# EAGLE design top (EAGLE 9.3.1)
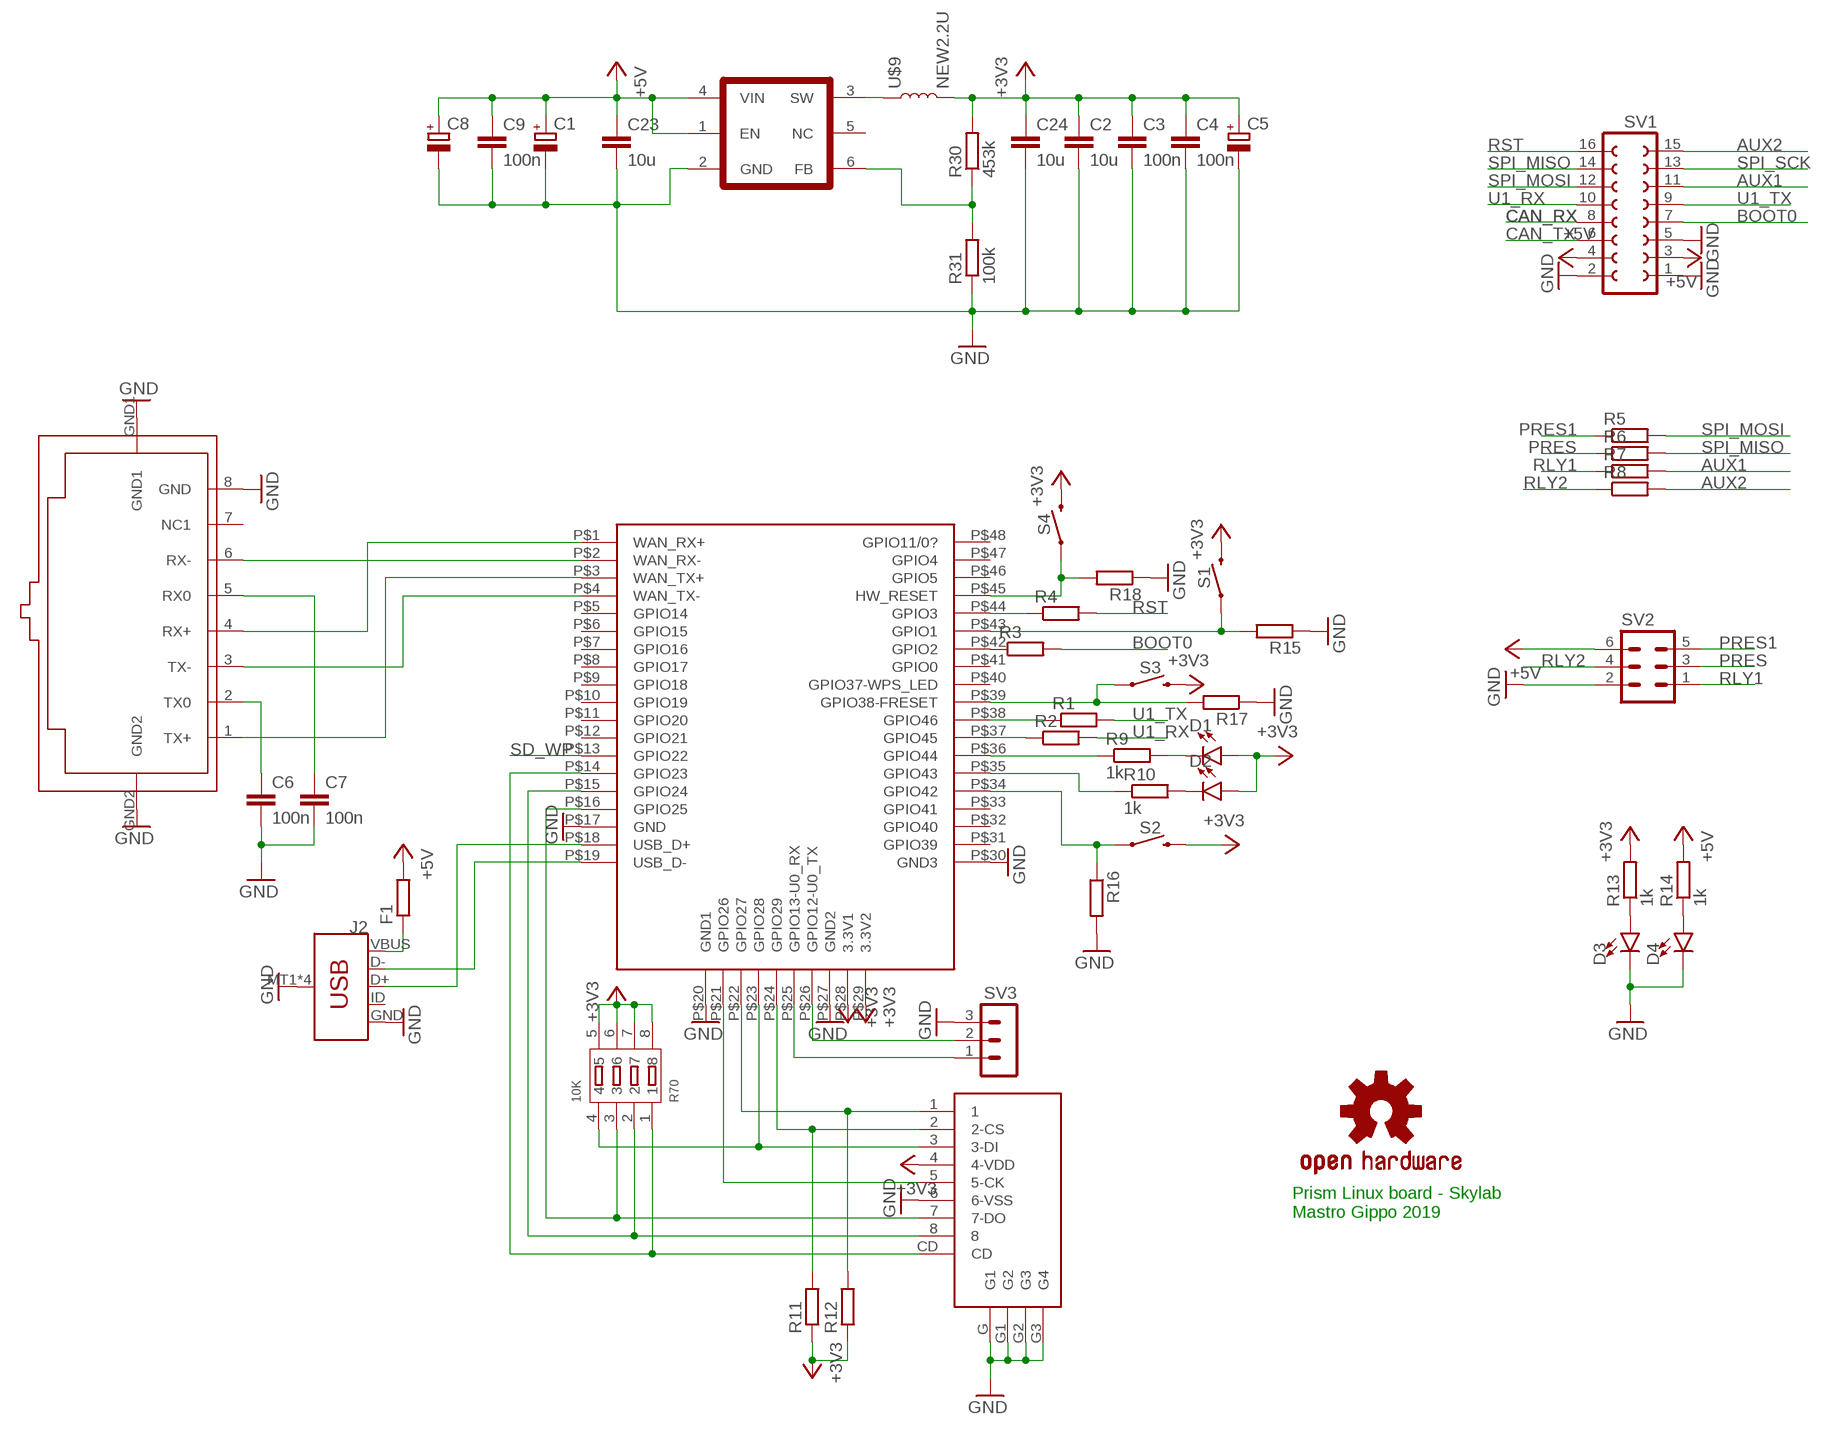
[diagram p0: schematic, sheet 1]

## Parts
C1  CPOL-EUB/3528-21R  [B/3528-21R]
C2  10u  C-EUC0805K  [C0805K]
C3  100n  C-EUC0805K  [C0805K]
C4  100n  C-EUC0805K  [C0805K]
C5  CPOL-EUB/3528-21R  [B/3528-21R]
C6  100n  C-EUC0805K  [C0805K]
C7  100n  C-EUC0805K  [C0805K]
C8  CPOL-EUB/3528-21R  [B/3528-21R]
C9  100n  C-EUC0805K  [C0805K]
C23  10u  C-EUC0805K  [C0805K]
C24  10u  C-EUC0805K  [C0805K]
D1  LED3MM  [LED_3MM]
D2  LED3MM  [LED_3MM]
D3  LED1206  [LED-1206]
D4  LED1206  [LED-1206]
F1  R-EU_R0603  [R0603]
J2  USB_MICRO-B_SMT  [USB-MICROB]
R1  R-EU_R0805  [R0805]
R2  R-EU_R0805  [R0805]
R3  R-EU_R0805  [R0805]
R4  R-EU_R0805  [R0805]
R5  R-EU_R0805  [R0805]
R6  R-EU_R0805  [R0805]
R7  R-EU_R0805  [R0805]
R8  R-EU_R0805  [R0805]
R9  1k  R-EU_R0805  [R0805]
R10  1k  R-EU_R0805  [R0805]
R11  R-EU_R0805  [R0805]
R12  R-EU_R0805  [R0805]
R13  1k  R-EU_R0805  [R0805]
R14  1k  R-EU_R0805  [R0805]
R15  R-EU_R0805  [R0805]
R16  R-EU_R0805  [R0805]
R17  R-EU_R0805  [R0805]
R18  R-EU_R0805  [R0805]
R30  453k  R_EU  [R0805]
R31  100k  R_EU  [R0805]
R70  10K  SMD-RES-ARRAY-1K-4R(RA1206-8)  [RA1206-8]
S1  MOMENTARY-SWITCH-SPST-SMD-6.0X3.5MM  [TACTILE_SWITCH_SMD_6.0X3.5MM]
S2  MOMENTARY-SWITCH-SPST-SMD-6.0X3.5MM  [TACTILE_SWITCH_SMD_6.0X3.5MM]
S3  MOMENTARY-SWITCH-SPST-PTH-RIGHT-ANGLE  [TACTILE_SWITCH_PTH_RIGHT_ANGLE]
S4  MOMENTARY-SWITCH-SPST-SMD-6.0X3.5MM  [TACTILE_SWITCH_SMD_6.0X3.5MM]
SV1  FE08-2  [FE08-2]
SV2  MA03-2  [MA03-2]
SV3  MA03-1  [MA03-1]
U$1  RJ45-TRAFO  [RJ45-TRAFO]
U$2  SKW92B  [SKW92]
U$3  MICRO_SD  [MICRO_SD_C]
U$4  OSHW-LOGOS  [OSHW-LOGO-S]
U$8  TLV62658  [SOT23-6]
U$9  NEW2.2U  [INDUCTOR_4X4MM]

## Nets
+3V3: C2.1 C3.1 C4.1 C5.+ C24.1 D1.A D2.A R11.1 R12.1 R13.2 R30.2 R70.5 R70.6 R70.7 R70.8 S1.2 S2.2 S3.2 S4.2 U$2.P$28(3.3V1) U$2.P$29(3.3V2) U$3.4(4-VDD) U$9.P$2
+5V: C1.+ C8.+ C9.1 C23.1 F1.2 R14.2 SV1.3 SV1.4 SV2.6 U$8.1(EN) U$8.4(VIN)
AUX1: R7.2 SV1.11
AUX2: R8.2 SV1.15
BOOT0: R3.2 SV1.7
CAN_RX: SV1.8
CAN_TX: SV1.6
GND: C1.- C2.2 C3.2 C4.2 C5.- C6.2 C7.2 C8.- C9.2 C23.2 C24.2 D3.C D4.C J2.GND J2.MT1(SHIELD) J2.MT2(SHIELD) J2.P$1(SHIELD) J2.P$2(SHIELD) R15.1 R16.2 R17.1 R18.1 R31.1 SV1.1 SV1.2 SV1.5 SV2.2 SV3.3 U$1.8(GND) U$1.GND1 U$1.GND2 U$2.P$17(GND) U$2.P$20(GND1) U$2.P$27(GND2) U$2.P$30(GND3) U$3.6(6-VSS) U$3.G1(G2) U$3.G2(G3) U$3.G3(G4) U$3.G(G1) U$8.2(GND)
N$1: U$1.6(RX-) U$2.P$2(WAN_RX-)
N$2: U$1.4(RX+) U$2.P$1(WAN_RX+)
N$3: U$1.1(TX+) U$2.P$3(WAN_TX+)
N$4: U$1.3(TX-) U$2.P$4(WAN_TX-)
N$5: R11.2 U$2.P$24(GPIO29) U$3.2(2-CS)
N$6: R70.4 U$2.P$23(GPIO28) U$3.3(3-DI)
N$7: R12.2 U$2.P$22(GPIO27) U$3.1
N$8: U$2.P$21(GPIO26) U$3.5(5-CK)
N$9: R70.3 U$2.P$16(GPIO25) U$3.7(7-DO)
N$10: R70.2 U$2.P$15(GPIO24) U$3.8
N$11: R70.1 U$2.P$14(GPIO23) U$3.CD
N$12: R1.1 U$2.P$38(GPIO46)
N$13: R2.1 U$2.P$37(GPIO45)
N$14: R3.1 U$2.P$42(GPIO2)
N$15: R4.1 U$2.P$44(GPIO3)
N$16: D1.K(C) R9.2
N$17: SV3.2 U$2.P$26(GPIO12-U0_TX)
N$18: SV3.1 U$2.P$25(GPIO13-U0_RX)
N$19: D2.K(C) R10.2
N$20: R9.1 U$2.P$36(GPIO44)
N$21: R10.1 U$2.P$35(GPIO43)
N$22: D3.A R13.1
N$23: D4.A R14.1
N$24: R15.2 S1.1 U$2.P$43(GPIO1)
N$25: R16.1 S2.1 U$2.P$34(GPIO42)
N$26: R17.2 S3.1 U$2.P$39(GPIO38-FRESET)
N$27: R18.2 S4.1 U$2.P$45(HW_RESET)
N$28: C7.1 U$1.5(RX0)
N$29: C6.1 U$1.2(TX0)
N$30: J2.D+ U$2.P$18(USB_D+)
N$31: J2.D- U$2.P$19(USB_D-)
N$32: F1.1 J2.VBUS
N$41: U$8.3(SW) U$9.P$1
N$46: R30.1 R31.2 U$8.6(FB)
PRES: R6.1 SV2.3
PRES1: R5.1 SV2.5
RLY1: R7.1 SV2.1
RLY2: R8.1 SV2.4
RST: R4.2 SV1.16
SD_WP: U$2.P$13(GPIO22)
SPI_MISO: R6.2 SV1.14
SPI_MOSI: R5.2 SV1.12
SPI_SCK: SV1.13
U1_RX: R2.2 SV1.10
U1_TX: R1.2 SV1.9
Unconnected: J2.ID U$1.7(NC1) U$2.P$5(GPIO14) U$2.P$6(GPIO15) U$2.P$7(GPIO16) U$2.P$8(GPIO17) U$2.P$9(GPIO18) U$2.P$10(GPIO19) U$2.P$11(GPIO20) U$2.P$12(GPIO21) U$2.P$31(GPIO39) U$2.P$32(GPIO40) U$2.P$33(GPIO41) U$2.P$40(GPIO37-WPS_LED) U$2.P$41(GPIO0) U$2.P$46(GPIO5) U$2.P$47(GPIO4) U$2.P$48(GPIO11/0?) U$8.5(NC)

## Notes on the sheet
- Prism Linux board - Skylab
  Mastro Gippo 2019

## Library data of the parts
C1 C5 C8 = rcl:CPOL-EU: POLARIZED CAPACITOR, European symbol; SPICEPREFIX: C
C2-C4 C6 C7 C9 C23 C24 = resistor:C-EU: CAPACITOR, European symbol; SPICEPREFIX: C
D1 D2 = SparkFun-LED:LED: LED (Generic) Standard schematic elements and footprints for 5mm, 3mm, 1206, and 0603 sized LEDs. Generic LEDs with no color specified.; PROD_ID: DIO-08794
D3 D4 = SparkFun-LED:LED: LED (Generic) Standard schematic elements and footprints for 5mm, 3mm, 1206, and 0603 sized LEDs. Generic LEDs with no color specified.
F1 R1-R18 = rcl:R-EU_: RESISTOR, European symbol; SPICEPREFIX: R
J2 = SparkFun-Connectors:USB_MICRO-B: USB Type Micro-B Connector Male/female and PTH/SMT variants SparkFun Products: SparkFun microB USB Breakout <https://www.sparkfun.com/products/12035> SparkFun USB microB Plug Breakout <https://www.sparkfun.com/products/10031> SparkFun ESP8266 Thing <https://www.sparkfun.com/products/13231>; PROD_ID: CONN-09505; SF_ID: PRT-08533
R30 R31 = mastrogippo:R_EU
R70 = Seeed-Resistor-2016:SMD-RES-ARRAY-1K-4R(RA1206-8): 301030012; MPN: Chip-Array-Series-1%; VALUE: 1K
S1 S2 S4 = SparkFun-Switches:MOMENTARY-SWITCH-SPST: Momentary Switch (Pushbutton) - SPST Normally-open (NO) SPST momentary switches (buttons, pushbuttons). Variants PTH-12MM - 12mm square, through-hole Momentary Pushbutton Switch - 12mm Square <https://www.sparkfun.com/products/9190> (COM-09190) PTH-6.0MM, PTH-6.0MM-KIT - 6.0mm square, through-hole Mini Pushbutton Switch <https://www.sparkfun.com/products/97> (COM-00097) KIT package intended for soldering kit's - only one side of pads' copper is exposed. PTH-RIGHT-ANGLE-KIT - Right-angle, through-hole Right Angle Tactile Button <https://www.sparkfun.com/products/10791> - Used on SparkFun BigTime Watch Kit <https://www.sparkfun.com/products/11734> SMD-12MM - 12mm square, surface-mount Tactile Button - SMD (12mm) <https://www.sparkfun.com/products/12993> (COM-12993) Used on SparkFun PicoBoard <https://www.sparkfun.com/products/11888> SMD-4.5MM - 4.5mm Square Trackball Switch Used on SparkFun Blackberry Trackballer Breakout <https://www.sparkfun.com/products/13169> SMD-4.6MMX2.8MM - 4.60mm x 2.80mm, surface mount Used on SparkFun SAMD21 Mini Breakout <https://www.sparkfun.com/products/13664> SMD-5.2MM, SMD-5.2-REDUNDANT - 5.2mm square, surface-mount Mini Pushbutton Switch - SMD <https://www.sparkfun.com/products/8720> (COM-08720) Used on Arduino Pro Mini <https://www.sparkfun.com/products/11114> REDUNDANT package connects both switch circuits together SMD-6.0X3.5MM - 6.0 x 3.5mm, surface mount Momentary Reset Switch SMD <https://www.sparkfun.com/products/8229> (COM-08229) SMD-6.2MM-TALL - 6.2mm square, surface mount Tactile Button - SMD (6mm) <https://www.sparkfun.com/products/12992> Used on SparkFun Digital Sandbox <https://www.sparkfun.com/products/12651> SMD-RIGHT-ANGLE - Right-angle, surface mount Used on SparkFun Block for Intel® Edison - Arduino <https://www.sparkfun.com/products/13036>; PROD_ID: SWCH-00815; SF_SKU: COM-08229
S3 = SparkFun-Switches:MOMENTARY-SWITCH-SPST: Momentary Switch (Pushbutton) - SPST Normally-open (NO) SPST momentary switches (buttons, pushbuttons). Variants PTH-12MM - 12mm square, through-hole Momentary Pushbutton Switch - 12mm Square <https://www.sparkfun.com/products/9190> (COM-09190) PTH-6.0MM, PTH-6.0MM-KIT - 6.0mm square, through-hole Mini Pushbutton Switch <https://www.sparkfun.com/products/97> (COM-00097) KIT package intended for soldering kit's - only one side of pads' copper is exposed. PTH-RIGHT-ANGLE-KIT - Right-angle, through-hole Right Angle Tactile Button <https://www.sparkfun.com/products/10791> - Used on SparkFun BigTime Watch Kit <https://www.sparkfun.com/products/11734> SMD-12MM - 12mm square, surface-mount Tactile Button - SMD (12mm) <https://www.sparkfun.com/products/12993> (COM-12993) Used on SparkFun PicoBoard <https://www.sparkfun.com/products/11888> SMD-4.5MM - 4.5mm Square Trackball Switch Used on SparkFun Blackberry Trackballer Breakout <https://www.sparkfun.com/products/13169> SMD-4.6MMX2.8MM - 4.60mm x 2.80mm, surface mount Used on SparkFun SAMD21 Mini Breakout <https://www.sparkfun.com/products/13664> SMD-5.2MM, SMD-5.2-REDUNDANT - 5.2mm square, surface-mount Mini Pushbutton Switch - SMD <https://www.sparkfun.com/products/8720> (COM-08720) Used on Arduino Pro Mini <https://www.sparkfun.com/products/11114> REDUNDANT package connects both switch circuits together SMD-6.0X3.5MM - 6.0 x 3.5mm, surface mount Momentary Reset Switch SMD <https://www.sparkfun.com/products/8229> (COM-08229) SMD-6.2MM-TALL - 6.2mm square, surface mount Tactile Button - SMD (6mm) <https://www.sparkfun.com/products/12992> Used on SparkFun Digital Sandbox <https://www.sparkfun.com/products/12651> SMD-RIGHT-ANGLE - Right-angle, surface mount Used on SparkFun Block for Intel® Edison - Arduino <https://www.sparkfun.com/products/13036>; PROD_ID: CONN-10672; SF_SKU: COM-10791
SV1 = con-lsta:FE08-2: FEMALE HEADER; OC_FARNELL: unknown; OC_NEWARK: unknown
SV2 = con-lstb:MA03-2: PIN HEADER; OC_FARNELL: unknown; OC_NEWARK: unknown
SV3 = con-lstb:MA03-1: PIN HEADER; OC_FARNELL: unknown; OC_NEWARK: unknown
U$1 = con-amphenol-rj45-ld:RJ45-TRAFO: RJ45 socket with integrated magnetics Naming: Amphenol LMJ1598824110DT39 TME RJ45-TRAFO Author: Petr Kalandra <mailto:kalandrap@gmail.com> Datasheet: http://zefiryn.tme.pl/dok/zlacza/rjtrafo.pdf
U$2 = mastrogippo:SKW92B
U$3 = DueCan:MICRO_SD
U$4 = mastrogippo:OSHW-LOGO: Open Source Hardware Logo This logo indicates the piece of hardware it is found on incorporates a OSHW license and/or adheres to the definition of open source hardware found here: http://freedomdefined.org/OSHW
U$8 = mastrogippo:TLV62658
U$9 = SparkFun-Coils:NEW2.2U

## Board
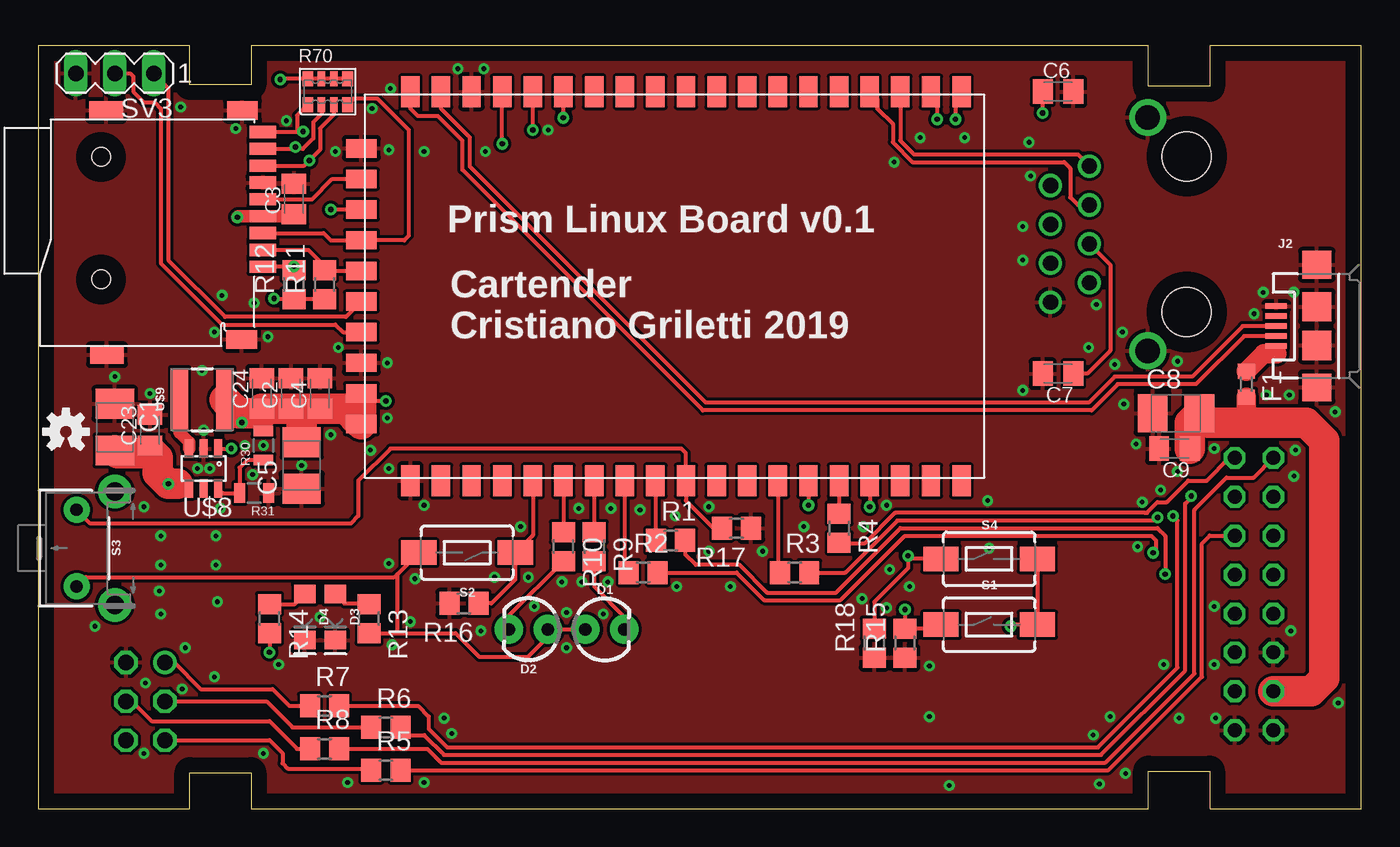
[diagram p1: board, top side]
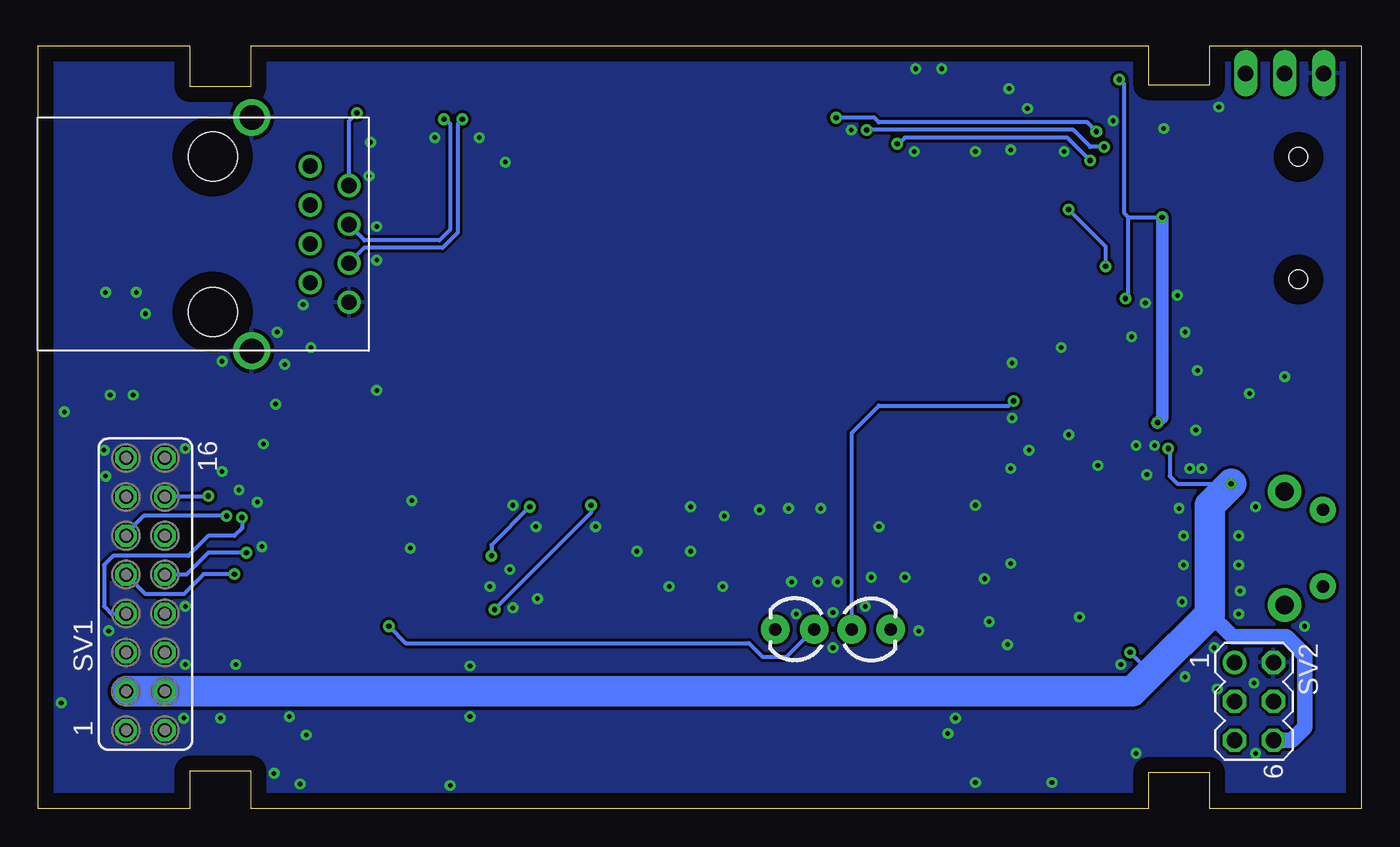
[diagram p2: board, bottom side, seen from below]

Size 86.4 x 49.8 mm. Coordinates in mm from the lower left corner, seen from the top.
Outline: 0,49.8 0,0 9.9,0 9.9,2.34 13.9,2.34 13.9,0 72.5,0 72.5,2.44 76.5,2.44 76.5,0 86.4,0 86.4,49.8 76.5,49.8 76.5,47.16 72.5,47.16 72.5,49.8 13.9,49.8 13.9,47.26 9.9,47.26 9.9,49.8 0,49.8
Copper layers (1*16): Top 0.035mm / dielectric 1.5mm / Bottom 0.035mm
Design rules "default *": minimum track width 6mil, minimum drill 0.3mm, track to track 6mil, track to pad 6mil, pad to pad 6mil, via to via 6mil, smd to smd 6mil, copper to edge 40mil, drill to drill 6mil, minimum pad ring 10mil, minimum via ring 8mil, stop-mask expansion 4mil, vias tented up to drill 0mil, thermal gap 10mil

### Footprints (pad centres in the part's own frame; a part is rotated, then mirrored left to right if it is on the bottom)
B/3528-21R = smd 1.95 x 2.5: + 1.525,0; - -1.525,0
C0805K = smd 1.3 x 1.6: 1 -1,0; 2 1,0
LED_3MM = drill 0.813 pad 1.88: A -1.27,0; K 1.27,0
LED-1206 = smd 1.2 x 1.4: A -1.5,0; C 1.5,0
R0603 = smd 1 x 1.1: 1 -0.85,0; 2 0.85,0
USB-MICROB = smd 1.4 x 0.35: D+ -2.65,0; D- -2.65,-0.65; GND -2.65,1.3; ID -2.65,0.65; VBUS -2.65,-1.3 | smd 1.9 x 1.8: MT1 0,-4; MT2 0,4 | smd 1.9 x 1.9: P$1 0,-1.27; P$2 0,1.27
R0805 = smd 1.3 x 1.5: 1 -0.95,0; 2 0.95,0
R0805' = smd 0.7 x 1.3: 1 -0.95,0; 2 0.95,0
RA1206-8 = smd 0.7 x 1: 1 -1.3,-0.85; 4 1.3,-0.85; 5 1.3,0.85; 8 -1.3,0.85 | smd 0.5 x 1: 2 -0.4,-0.85; 3 0.4,-0.85; 6 0.4,0.85; 7 -0.4,0.85
TACTILE_SWITCH_SMD_6.0X3.5MM = smd 2.3 x 1.6: 1 -3.15,0; 2 3.15,0
TACTILE_SWITCH_PTH_RIGHT_ANGLE = drill 0.8 pad 1.7: 1 -2.5,0; 2 2.5,0 | drill 1.2 pad 2.2: ANCHOR1 -3.703,2.5; ANCHOR2 3.703,2.5
FE08-2 = drill 0.914 octagon: 1 -8.89,1.27; 2 -8.89,-1.27; 3 -6.35,1.27; 4 -6.35,-1.27; 5 -3.81,1.27; 6 -3.81,-1.27; 7 -1.27,1.27; 8 -1.27,-1.27; 9 1.27,1.27; 10 1.27,-1.27; 11 3.81,1.27; 12 3.81,-1.27; 13 6.35,1.27; 14 6.35,-1.27; 15 8.89,1.27; 16 8.89,-1.27
MA03-2 = drill 1.016: 1 -2.54,-1.27 | drill 1.016 octagon: 2 -2.54,1.27; 3 0,-1.27; 4 0,1.27; 5 2.54,-1.27; 6 2.54,1.27
MA03-1 = drill 1.016 long: 1 -2.54,0; 2 0,0; 3 2.54,0
RJ45-TRAFO = drill 1: 1 -4.445,6.35; 2 -3.175,8.89; 3 -1.905,6.35; 4 -0.635,8.89; 5 0.635,6.35; 6 1.905,8.89; 7 3.175,6.35; 8 4.445,8.89 | drill 1.6: GND1 -7.62,2.54; GND2 7.62,2.54 | hole 3.2: -5.08,0; 5.08,0
SKW92 = smd 1.2 x 2: P$1 39,25.2; P$2 37,25.2; P$3 35,25.2; P$4 33,25.2; P$5 31,25.2; P$6 29,25.2; P$7 27,25.2; P$8 25,25.2; P$9 23,25.2; P$10 21,25.2; P$11 19,25.2; P$12 17,25.2; P$13 15,25.2; P$14 13,25.2; P$15 11,25.2; P$16 9,25.2; P$17 7,25.2; P$18 5,25.2; P$19 3,25.2; P$30 3,-0.2; P$31 5,-0.2; P$32 7,-0.2; P$33 9,-0.2; P$34 11,-0.2; P$35 13,-0.2; P$36 15,-0.2; P$37 17,-0.2; P$38 19,-0.2; P$39 21,-0.2; P$40 23,-0.2; P$41 25,-0.2; P$42 27,-0.2; P$43 29,-0.2; P$44 31,-0.2; P$45 33,-0.2; P$46 35,-0.2; P$47 37,-0.2; P$48 39,-0.2 | smd 2 x 1.2: P$20 -0.2,21.5; P$21 -0.2,19.5; P$22 -0.2,17.5; P$23 -0.2,15.5; P$24 -0.2,13.5; P$25 -0.2,11.5; P$26 -0.2,9.5; P$27 -0.2,7.5; P$28 -0.2,5.5; P$29 -0.2,3.5
MICRO_SD_C = smd 0.8 x 1.75: 1 2.83,7.07; 2 1.73,7.07; 3 0.63,7.07; 4 -0.47,7.07; 5 -1.57,7.07; 6 -2.67,7.07; 7 -3.77,7.07; 8 -4.87,7.07; CD -5.97,7.07 | smd 1.2 x 2: G 7.57,5.68; G1 -7.38,5.73 | smd 1.2 x 2.2: G2 -7.38,-3.17; G3 8.57,-3.12 | hole 1.2: -4.35,-3.5; 3.65,-3.5
SOT23-6 = smd 0.55 x 1.2: 1 -0.95,-1.3; 2 0,-1.3; 3 0.95,-1.3; 4 0.95,1.3; 5 0,1.3; 6 -0.95,1.3
INDUCTOR_4X4MM = smd 4.089 x 1.143: P$1 0,1.473; P$2 0,-1.473

### Placement (x,y rotation side)
C1  5,24.9 270 top
C2  16.5,27.1 90 top
C3  16.7,39.8 90 top
C4  18.4,27.1 90 top
C5  17.2,22.4 90 top
C6  66.6,46.8 0 top
C7  66.6,28.4 180 top
C8  74.3,25.8 0 top
C9  74.2,23.5 180 top
C23  7.3,24.7 90 top
C24  14.6,27.1 90 top
D1  37,11.7 0 top
D2  32,11.7 180 top
D3  19.4,12.5 270 top
D4  17.4,12.5 270 top
F1  78.9,27.7 270 top
J2  83.5,31.5 0 top
R1  41.3,17.5 0 top
R2  39.5,15.4 0 top
R3  49.4,15.4 0 top
R4  52.3,18.3 270 top
R5  22.7,2.5 0 top
R6  22.7,5.3 0 top
R7  18.7,6.7 0 top
R8  18.7,3.9 0 top
R9  36.3,17.1 270 top
R10  34.3,17.1 270 top
R11  18.7,34.2 90 top
R12  16.7,34.2 90 top
R13  21.6,12.4 270 top
R14  15.1,12.4 270 top
R15  56.6,10.8 90 top
R16  27.8,13.4 180 top
R17  45.6,18.3 180 top
R18  54.6,10.8 90 top
R30  453k  [R0805']  14.7,23.7 90 top
R31  100k  [R0805']  14.1,20.6 180 top
R70  18.9,46.8 0 top
S1  62.1,12 0 top
S2  28,16.7 180 top
S3  2.5,17 270 top
S4  62.1,16.3 0 top
SV1  79.4,14 90 bottom
SV2  7,7 270 bottom
SV3  5,48 180 top
U$1  75,37.5 270 bottom
U$2  21.3,21.6 0 top
U$3  7.6,38.2 270 top
U$4  1.8,24.6 0 top
U$8  10.8,22.2 180 top
U$9  10.7,26.7 90 top

### Tracks (layer width: path | path; a pad name or v marks a point on that pad's centre or on a via)
+3V3  (via drill 0.35)
  Top 0.254: R30.2 14.7,25.8 | 14.6,25.8 C24.1 | D2.A 33.3,11.7 | 33.3,11.7 D1.A | v22.7,26.6 21.1,26.6 | R70.5 R70.6 R70.7 R70.8 15.85,47.65 v15.8,47.6 | R11.1 R12.1 15.45,33.25 v15.4,33.3 | R13.2 23.5,11.45 | 23.5,11.45 27.25,11.45 28.8,9.9 32,9.9 33.3,11.2 33.3,11.7 | S3.2 3.1,15.1 23.25,15.1 23.43,15.28 | 23.43,15.28 S2.2 | 23.43,15.28 23.43,11.53 23.5,11.45 | S4.2 S1.2 63.6,12 v63.5,11.9 | C2.1 17.3,26.1 C4.1 | v13.3,25.2 13.3,25.8 13.07,25.8
  Top 0.813: C3.1 16.57,38.67 U$3.4 13.07,38.67 v13,38.6
  Top 1.016: U$2.P$28 21.1,26.6
  Top 2: U$9.P$2 13.07,25.8 14.6,25.8 14.7,25.8 | 17.3,26.1 20.1,26.1 U$2.P$29 21.1,26.6 | 17.3,26.1 C24.1 | C5.+ 17.2,26 17.3,26.1
  Bottom 0.254: D2.A 33.27,24.53 31.5,26.3 23,26.3 v22.7,26.6 | v15.8,47.6 15.5,47.3 15.5,38.9 15.2,38.6 | 15.2,38.6 v13,38.6 | v15.4,33.3 15.2,33.5 15.2,38.6 | v63.5,11.9 62.4,10.8 40,10.8 39.1,9.9 37.53,9.9 D1.A
  Bottom 0.813: v13,38.6 13,25.5 v13.3,25.2
+5V  (via drill 0.35)
  Top 0.254: C23.1 7.5,23.5 7.5,23.2 | v8.5,21.2 8.8,20.9 U$8.4 | U$8.1 v12.6,23.5 | R14.2 v15.1,10.2
  Top 1.27: F1.2 78.9,25.2
  Top 2: C1.+ 5.18,23.2 7.5,23.2 7.8,22.9 7.8,21.9 v8.5,21.2 9.1,21.2 | SV1.3 83.15,7.65 84,8.5 84,24 82.8,25.2 78.9,25.2 76.43,25.2 C8.+ 75.2,25.18 C9.1
  Bottom 0.254: v12.6,23.5 12.5,23.4 12.5,21.7 12,21.2 v8.5,21.2 | v15.1,10.2 14.1,9.2 13.8,9.2 13.8,8.8
  Bottom 1.016: SV2.6 4.54,4.46 3.7,5.3 3.7,10 4.9,11.2 8.4,11.2 9.9,12.7
  Bottom 2: SV1.3 SV1.4 14.95,7.65 13.8,8.8 9.9,12.7 9.9,19.8 v8.5,21.2
AUX1  (via drill 0.35)
  Top 0.254: R7.2 24.8,6.7 25.5,6 25.5,5.2 26.7,4 69.2,4 74.4,9.2 74.4,18.8 v74.1,19.1
  Bottom 0.254: v74.1,19.1 79.5,19.1 80.67,17.93 SV1.11
AUX2
  Top 0.254: SV1.15 79.38,21.6 77.6,21.6 75.5,19.5 75.5,8.8 69.7,3 26.3,3 25.4,3.9 R8.2
BOOT0  (via drill 0.35)
  Top 0.254: R3.2 52.7,15.4 56.1,18.8 72.9,18.8 v73.1,19
  Bottom 0.254: v73.1,19 73.1,18.3 73.6,17.8 75.3,17.8 76.6,16.5 81.5,16.5 82.1,15.9 82.1,13.2 81.6,12.7 81.57,12.73 SV1.7
GND  (via drill 0.3)
  other vias: 10.4,22.2 11.2,22.2 13.5,23.7 10.8,24.7 10.7,28.6 7.3,27.1 5,28.2 6.9,19.7 11.9,19.6 14,21.8 14.7,23.7 17.2,22.4 19.1,24.4 22.8,25.5 35.3,19.6 39.3,19.5 22.9,22.2 25.2,19.8 21.7,23.4 22.8,29.1 19.6,30.1 19.4,42.9 22.9,43 25.2,42.9 29.2,42.9 33.3,44.3 27.4,48.3 29.1,48.3 23,47 21.8,45.7 12.9,44.4 16.2,44.9 9.3,45.8 11.5,31.1 12,33.5 14.1,33 15,30.8 72.1,20 71.8,17.1 56.9,14.5 53.9,18.4 50,18.4 53.8,13.7 55.4,13.1 47.3,16.8 45.2,14.5 43.8,16.8 41.6,19.1 43.8,19.7 41.7,14.5 37.4,19.6 37.2,14.8 35.5,14.8 34.2,14.8 32.4,13.2 32,15.1 31.5,18.4 29.8,15.1 28.9,11.6 34.5,10.5 34.5,12.8 36.9,12.7 24.3,12.2 23.1,10.7 18.4,12.5 70.9,26.4 71.7,23.8 68.6,30.1 64.3,27.3 70.8,31.1 69.1,32.9 74.4,29.2 79.4,32.3 80,33.7 80.2,27 84.7,25.9 82.1,23.4 81.8,11.6 84.9,6.9 76.9,5.9 76.8,9.4 76.8,13.2 73.5,9.4 74.5,5.9 70,6 68.9,4.8 71,2.3 69.3,1.6 58.2,9.3 58.2,6 59.5,1.5 26.5,5.9 27,4.9 25.2,1.7 20.2,1.7 14.7,3.6 11.5,8.6 11.7,13.5 15.7,9.4 24.6,15 22.9,16 8,15.9 11.6,15.9 11.6,17.8 8,17.8 7.9,14.2 8,12.7 9.6,10.5 3.7,11.9 6.9,3.6 7,8.2 9.4,7.8 76.8,23.5 81.7,27 82,33.7 64.7,43.5 64.8,41.3 64.3,38 64.3,35.8 57.6,43.8 55.9,42.2 60.5,43.8 70.3,29 82,21.7 74.4,22 73.3,20.8 55.6,15.6 62.1,17 62,20.1 55.4,19.8
  pour Top (isolate 0.2): 0,49.8 0,0 86.4,0 86.4,49.8
  pour Bottom (isolate 0.2): 0,49.8 0,0 86.4,0 86.4,49.8
N$1  (via drill 0.35)
  Top 0.254: U$2.P$2 58.7,46.4 v58.7,45
  Bottom 0.254: v58.7,45 59,44.7 59,37.6 60,36.6 65.11,36.6 U$1.6
N$2  (via drill 0.35)
  Top 0.254: U$2.P$1 60.3,46.3 59.9,45.9 v59.9,45
  Bottom 0.254: v59.9,45 59.8,45 59.5,44.7 59.5,37.8 60.2,37.1 65.1,37.1 66.11,38.11 U$1.4
N$3
  Top 0.254: U$2.P$3 56.3,43.6 57.2,42.7 67.9,42.7 U$1.1
N$4
  Top 0.254: U$2.P$4 54.8,46.3 54.8,45.7 55.8,44.7 55.8,43.5 57.1,42.2 67,42.2 67.4,41.8 67.4,39.9 67.9,39.41 U$1.3
N$5
  Top 0.254: U$3.2 17.63,36.47 19,35.1 | 19,35.1 U$2.P$24 | R11.2 19,35.15 19,35.1
N$6
  Top 0.254: U$3.3 18.63,37.57 19.1,37.1 U$2.P$23 23.9,37.1 24.2,37.4 24.2,44.3 22.15,46.35 20.6,46.35 R70.4
N$7  (via drill 0.35)
  Top 0.254: U$2.P$22 v19.1,39.1 | v16.7,35.4 16.67,35.37 | 16.67,35.37 U$3.1 | R12.2 16.67,35.15 16.67,35.37
  Bottom 0.254: v19.1,39.1 16.7,36.7 v16.7,35.4
N$8
  Top 0.254: U$3.5 17.87,39.77 19.2,41.1 U$2.P$21
N$9  (via drill 0.35)
  Top 0.254: U$3.7 17.37,41.97 v17.7,42.3 18.4,43 18.4,44.4 19.3,45.3 R70.3 | v30.3,43.4 U$2.P$16
  Bottom 0.254: v30.3,43.4 30.2,43.4 29.8,43.8 19.2,43.8 v17.7,42.3
N$10  (via drill 0.35)
  Top 0.254: U$3.8 16.77,43.07 | v16.8,43.2 16.8,43.1 16.77,43.07 | v32.3,44.3 U$2.P$15 | R70.2 18.5,45.35 17.96,44.81 17.96,43.76 17.27,43.07 16.77,43.07
  Bottom 0.254: v16.8,43.2 17.7,43.2 18.8,44.3 v32.3,44.3
N$11  (via drill 0.35)
  Top 0.254: U$3.CD 14.7,44.2 16.9,44.2 | 16.9,44.2 v17.3,44.2 | v34.3,45.1 U$2.P$14 | R70.1 16.9,45.25 16.9,44.2
  Bottom 0.254: v17.3,44.2 17.9,44.8 31.5,44.8 31.8,45.1 v34.3,45.1
N$12
  Top 0.254: U$2.P$38 40.3,17.55 R1.1
N$13
  Top 0.254: U$2.P$37 38.3,15.65 R2.1
N$14
  Top 0.254: U$2.P$42 48.3,15.55 R3.1
N$15
  Top 0.254: U$2.P$44 R4.1
N$16
  Top 0.254: R9.2 36.3,14.5 38.3,12.5 38.3,11.73 D1.K
N$17
  Top 0.254: SV3.2 6,48 6.2,47.8 6.2,46.8 6.9,46.1 7.6,46.1 8,45.7 8,35.6 12,31.6 19.4,31.6 19.9,31.1 U$2.P$26
N$18
  Top 0.254: SV3.1 8.5,47.04 8.5,35.8 12.2,32.1 20.1,32.1 U$2.P$25
N$19
  Top 0.254: R10.2 30.73,12.58 D2.K
N$20
  Top 0.254: U$2.P$36 R9.1
N$21
  Top 0.254: U$2.P$35 R10.1
N$22
  Top 0.254: D3.A 20,13.4 21.55,13.4 R13.1
N$23
  Top 0.254: R14.1 16.75,13.35 D4.A
N$24  (via drill 0.35)
  Top 0.254: U$2.P$43 v50.3,19.8 | v56.6,13 R15.2 58.95,11.75 S1.1
  Bottom 0.254: v56.6,13 50.3,19.3 v50.3,19.8
N$25
  Top 0.254: U$2.P$34 32.3,17.85 S2.1 31.15,14.95 29.6,13.4 R16.1
N$26
  Top 0.254: R17.2 44.1,18.3 42.3,20.1 U$2.P$39 42.3,23.2 42,23.5 23,23.5 20.9,21.4 20.9,19.1 20.4,18.6 3.4,18.6 S3.1
N$27  (via drill 0.35)
  Top 0.254: U$2.P$45 v54.3,19.7 | S4.1 57,16.3 v56.8,16.5 56.8,15.7 54.6,13.5 R18.2
  Bottom 0.254: v54.3,19.7 56.8,17.2 v56.8,16.5
N$28
  Top 0.254: U$1.5 70,35.52 70,29.9 68.5,28.4 C7.1
N$29  (via drill 0.35)
  Top 0.254: v65.6,45.4 C6.1
  Bottom 0.254: U$1.2 66.11,44.89 v65.6,45.4
N$30
  Top 0.254: J2.D+ 78.66,31.5 75.36,28.2 70.3,28.2 68.6,26.5 43.6,26.5 28.2,41.9 28.2,43.8 26.3,45.7 U$2.P$18
N$31
  Top 0.254: J2.D- 78.75,30.85 75.6,27.7 70.5,27.7 68.8,26 43.4,26 27.7,41.7 27.7,43.6 26.1,45.2 24.8,45.2 24.3,45.7 U$2.P$19
N$32
  Top 0.254: J2.VBUS 80.85,29.75 80.9,29.7
  Top 1.27: F1.1 80.05,29.7 80.9,29.7
N$41
  Top 0.813: U$8.3 9.85,23.9 9.23,24.53 U$9.P$1
N$46
  Top 0.254: U$8.6 12.05,20.6 R31.2 13.15,22.25 13.65,22.75 R30.1
PRES
  Top 0.254: SV2.3 14.9,7 16.6,5.3 R6.1
PRES1
  Top 0.254: SV2.5 15.1,4.46 15.95,3.62 15.95,2.96 16.3,2.6 21.65,2.6 R5.1
RLY1
  Top 0.254: SV2.1 8.86,9.54 10.6,7.8 15.3,7.8 16.4,6.7 R7.1
RLY2
  Top 0.254: SV2.4 6.1,7 7.4,5.7 15.1,5.7 16.9,3.9 R8.1
RST
  Top 0.254: R4.2 52.35,17.3 53.95,17.3 55.95,19.3 72.3,19.3 72.4,19.3 73.1,20 73.7,20 75.1,21.4 76.3,21.4 77.79,22.89 SV1.16
SPI_MISO  (via drill 0.35)
  Top 0.254: R6.2 24.15,4.8 25.2,4.8 26.5,3.5 69.4,3.5 74.9,9 74.9,19.9 75.3,20.3 v75.3,20.4
  Bottom 0.254: v75.3,20.4 75.35,20.35 SV1.14
SPI_MOSI
  Top 0.254: R5.2 69.9,2.5 76,8.6 76,17.3 76.51,17.81 SV1.12
U1_RX  (via drill 0.35)
  Top 0.254: R2.2 45.6,15.4 47.4,13.6 52.4,13.6 56.6,17.8 72.7,17.8 73,17.5 73,16.9 v72.8,16.7
  Bottom 0.254: v72.8,16.7 75.3,16.7 76.73,15.27 SV1.10
U1_TX  (via drill 0.35)
  Top 0.254: R1.2 42.25,16.6 42.95,15.9 45.8,15.9 47.6,14.1 52.1,14.1 56.3,18.3 73.1,18.3 73.6,17.8 v73.6,15.3
  Bottom 0.254: v73.6,15.3 75.6,15.3 76.9,14 79.4,14 SV1.9

### Text on the board
tNames: Prism Linux Board v0.1 | Cartender / Cristiano Griletti 2019
tValues: bordo esterno PCB